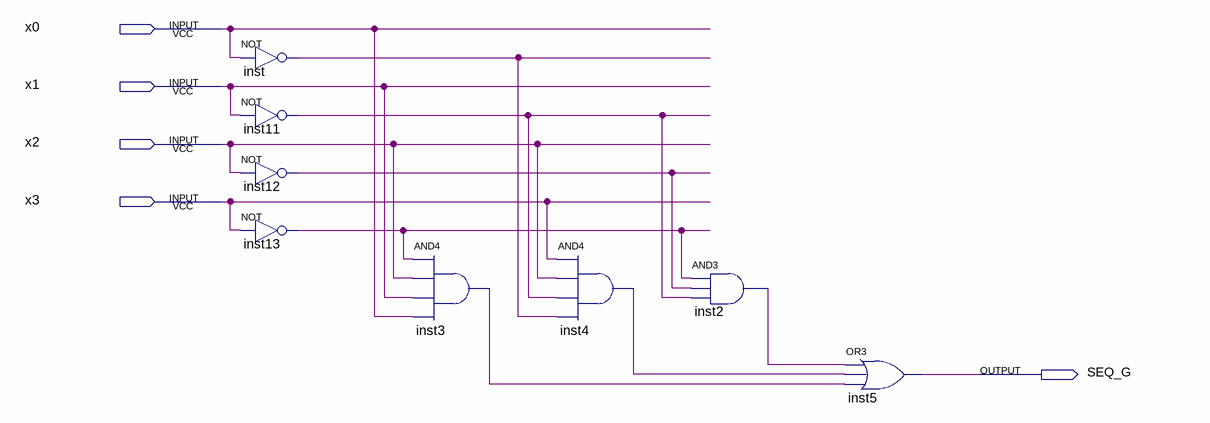
[diagram p0: schematic sheet]
// Quartus schematic SEQ_G.bdf as structural Verilog: 8 symbols, 5 pins
module SEQ_G (
  input  x0,
  input  x1,
  input  x2,
  input  x3,
  output SEQ_G
);

  wire inst2_out, inst3_out, inst4_out, inst11_out, inst12_out, inst13_out, inst_out;

  not inst (inst_out, x0);
  not inst11 (inst11_out, x1);
  not inst12 (inst12_out, x2);
  not inst13 (inst13_out, x3);
  and inst3 (inst3_out, inst13_out, x2, x1, x0);
  and inst4 (inst4_out, x3, x2, inst11_out, inst_out);
  and inst2 (inst2_out, inst13_out, inst12_out, inst11_out);
  or inst5 (SEQ_G, inst2_out, inst4_out, inst3_out);
endmodule
